# EAGLE design Enclosure 100x68 BHWL3 (EAGLE 9.6.2)
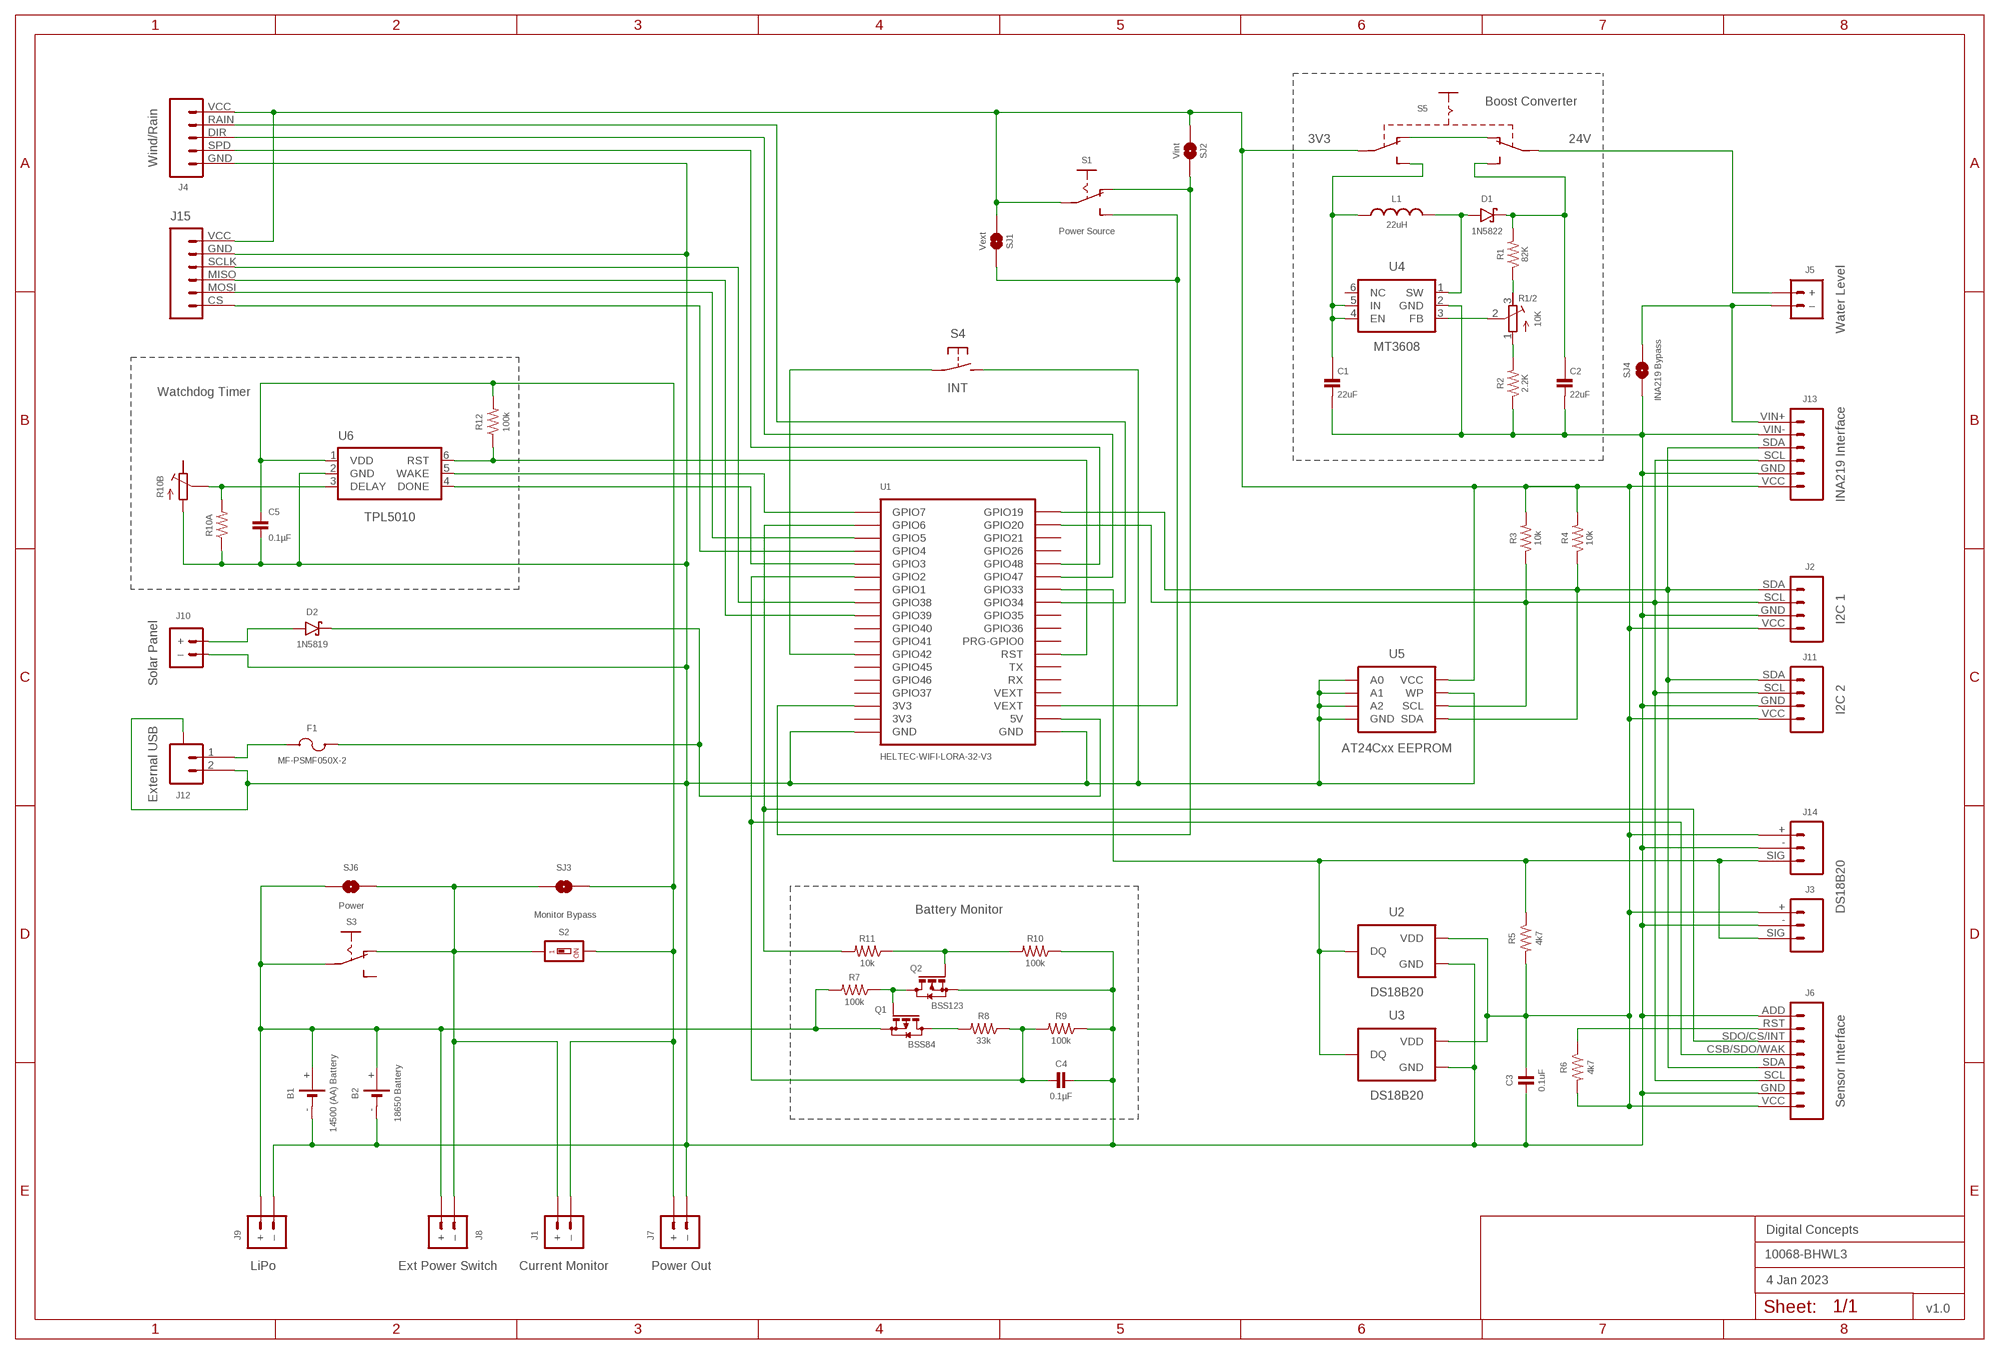
[diagram p0: schematic, sheet 1]
FRAME2 (A3L-LOC): DATE: 4 Jan 2023; OWNER: Digital Concepts; TITLE: 10068-BHWL3; VERSION: v1.0

## Parts
B1  14500 (AA) Battery  BATTERY-HOLDER-14500(AA)  [BATTERY-14500]
B2  18650 Battery  BATTERY-HOLDER-18650  [BATTERY-18650]
C1  22uF  CAPACITOR-1206  [C1206]
C2  22uF  CAPACITOR-1206  [C1206]
C3  0.1uF  CAPACITOR-0805  [C0805]
C4  0.1µF  CAPACITOR-0805  [C0805]
C5  0.1µF  CAPACITOR-0805  [C0805]
D1  1N5822  DIODE-SCHOTTKY-1N5822  [DIODE_SMB]
D2  1N5819  1N5819-SOD-123  [SOD-123]
F1  MF-PSMF050X-2  [F0805]
J1  Current Monitor  JST-PH2.0-2-HORIZONTALJST-PTH-2  [JST-PH2.0-2-HORIZONTAL]
J2  I2C 1  JST-PH2.0-4-VERTICAL-I2C  [JST-PH2.0-4-VERTICAL-I2C]
J3  DS18B20  JST-PH2.0-3-VERTICAL-DS18B20  [JST-PH2.0-3-VERTICAL-SIG]
J4  Wind/Rain  JST-PH2.0-5-DUAL-WEATHER  [JST-PH2.0-5-DUAL-WEATHER]
J5  Water Level  JST-PH2.0-2-DUAL-POWERJST-PTH-2  [JST-PH2.0-2-DUAL-POWER]
J6  Sensor Interface  HEADER-1X8-SENSOR  [CONN_08-SENSOR]
J7  Power Out  JST-GH1.25-2-HORIZONTAL-POWER  [JST-GH1.25-2-HORIZONTAL]
J8  Ext Power Switch  JST-PH2.0-2-DUAL-POWERJST-PTH-2  [JST-PH2.0-2-DUAL-POWER]
J9  LiPo  JST-PH2.0-2-HORIZONTAL-POWERJST-PTH-2  [JST-PH2.0-2-HORIZONTAL-POWER]
J10  Solar Panel  JST-PH2.0-2-VERTICAL  [JST-PH2.0-2-VERTICAL=POWER]
J11  I2C 2  JST-PH2.0-I2C-MALE-HORIZONTAL  [JST-PH2.0-4-HORIZONTAL]
J12  External USB  JST-SH1.0-2-SMD-HORIZONTAL  [JST-SH1.0-2-HORIZONTAL]
J13  INA219 Interface  INA219-I2C-MODULE  [CONN_06-INA219]
J14  JST-PH2.0-3-HORIZONTAL-DS18B20  [JST-PH2.0-DS18B20-HORIZONTAL]
J15  JST-PH2.0-6-HORIZONTAL-SPI  [JST-PH2.0-6-HORIZONTAL-SPI]
L1  22uH  INDUCTOR-CDRH104R/6D28L5038P  [CDRH104R+6D28]
Q1  BSS84  [SOT23-3]
Q2  BSS123  MOSFET-BSS123  [SOT23-3]
R1  82K  RESISTORR0805  [R0805]
R1/2  10K  RESISTOR-TRIMM-BAOTER-HORIZONTAL  [RTRIM64P]
R2  2.2K  RESISTORR0805  [R0805]
R3  10k  RESISTORR0805  [R0805]
R4  10k  RESISTORR0805  [R0805]
R5  4k7  RESISTORR0805  [R0805]
R6  4k7  RESISTORR0805  [R0805]
R7  100k  RESISTORR0805  [R0805]
R8  33k  RESISTORR0805  [R0805]
R9  100k  RESISTORR0805  [R0805]
R10  100k  RESISTORR0805  [R0805]
R10A  RESISTORR0805  [R0805]
R10B  RESISTOR-TRIMM-33  [RTRIM3*3]
R11  10k  RESISTORR0805  [R0805]
R12  100k  RESISTORR0805  [R0805]
S1  Power Source  SWITCH-SLIDE-SPDT-SMT  [SWITCH-SPDT-SMT]
S2  Monitor Bypass  SWITCH-DIP-SWS001  [SMD-001]
S3  Power  SWITCH-SLIDE-SPDT-PTH  [SWITCH-SPDT-PTH]
S4  INT  SWITCH-MOMENTARY-2-PIN  [SWITCH-2-PAD]
S5  SWITCH-SLIDE-DPDT-PTH-S  [SWITCH-DPDT-PTH]
SJ1  Vext  SJ  [SJ]
SJ2  Vint  SJ-V-2  [SJ-VIA-2]
SJ3  Monitor  SJ  [SJ]
SJ4  INA219 Bypass  SJ  [SJ]
SJ6  Power  SJ  [SJ]
U1  HELTEC-WIFI-LORA-32-V3  [HELTEC-WIFI-LORA-32-V3]
U2  DS18B20  THERMOMETER-DS18B20  [TO-92]
U3  DS18B20  THERMOMETER-DS18B20  [TO-92]
U4  MT3608  [SOT-23-6@1]
U5  AT24Cxx EEPROM  AT24CXX-EEPROM  [SOP-8]
U6  TPL5010  TPL5010DDCR  [SOT-23-6]

## Nets
GND: B1.- B2.- C1.2 C2.2 C3.2 C4.2 C5.2 J2.GND J3.- J4.GND J6.ADD J6.GND J7.-(–) J9.-(–) J10.-(–) J11.GND J12.2 J12.A@1(A) J12.A@2(A) J13.GND J13.VIN- J14.- J15.GND Q2.2(S) R2.1 R9.1 R10.1 R10A.1 R10B.1(A) S4.P$2(S) SJ4.1 U1.GND@1(GND) U1.GND@36(GND) U2.1(GND) U3.1(GND) U4.2(GND) U5.P$1(A0) U5.P$2(A1) U5.P$3(A2) U5.P$4(GND) U5.P$7(WP) U6.2(GND)
N$1: D2.A J10.+
N$2: J3.SIG J14.SIG R5.1 U1.GPIO33 U2.2(DQ) U3.2(DQ)
N$3: C4.1 J6.CSB/SDO/WAK R8.1 R9.2 U1.GPIO2
N$4: J2.SCL J6.SCL J11.SCL J13.SCL R3.1 U1.GPIO20 U5.P$6(SCL)
N$5: D2.C F1.1 U1.5V
N$6: D1.A L1.1 U4.1(SW)
N$7: Q1.3(D) R8.2
N$9: J6.RST R6.1
N$10: C5.1 J1.2(–) J7.+ R12.2 S2.2 SJ3.1 U6.1(VDD)
N$11: J2.SDA J6.SDA J11.SDA J13.SDA R4.1 U1.GPIO19 U5.P$5(SDA)
N$12: U1.GPIO7 U6.5(WAKE)
N$13: S1.3(S) SJ1.1 U1.VEXT@3(VEXT)
N$14: F1.2 J12.1
N$15: J5.-(–) J13.VIN+ SJ4.2
N$16: S4.P$1(P) U1.GPIO42
N$17: R1.1 R1/2.3(E)
N$18: R10A.2 R10B.2(S) U6.3(DELAY)
N$19: S1.1(O) SJ2.1 U1.3V3@34(3V3)
N$20: J5.+ S5.P$2(P1)
N$21: J1.1(+) J8.-(–) S2.1 S3.1(O) SJ3.2 SJ6.1
N$22: R1/2.2(S) U4.3(FB)
N$23: R1/2.1(A) R2.2
N$24: U1.GPIO3 U6.4(DONE)
N$25: C1.1 L1.2 S5.P$6(S2) U4.4(EN) U4.5(IN)
N$26: S5.P$1(O1) S5.P$4(O2)
N$27: J15.SCLK U1.GPIO38
N$28: C2.1 D1.C R1.2 S5.P$3(S1)
N$29: J15.MOSI U1.GPIO5
N$30: B1.+ B2.+ J8.+ J9.+ Q1.2(S) R7.2 S3.2(P) SJ6.2
N$31: J15.MISO U1.GPIO39
N$32: J6.SDO/CS/INT R11.2 U1.GPIO6
N$33: J15.CS U1.GPIO4
N$34: R12.1 U1.RST U6.6(RST)
N$35: Q1.1(G) Q2.3(D) R7.1
N$37: Q2.1(G) R10.2 R11.1
N$38: J4.SPD U1.GPIO48
N$39: J4.DIR U1.GPIO47
N$40: J4.RAIN U1.GPIO34
VEXT: C3.1 J2.VCC J3.+ J4.VCC J6.VCC J11.VCC J13.VCC J14.+ J15.VCC R3.2 R4.2 R5.2 R6.2 S1.2(P) S5.P$5(P2) SJ1.2 SJ2.2 SJ2.2@V U2.3(VDD) U3.3(VDD) U5.P$8(VCC)
Unconnected: R10B.3(E) S3.3(S) U1.3V3@35(3V3) U1.GPIO0(PRG-GPIO0) U1.GPIO1 U1.GPIO21 U1.GPIO26 U1.GPIO35 U1.GPIO36 U1.GPIO37 U1.GPIO40 U1.GPIO41 U1.GPIO45 U1.GPIO46 U1.RX U1.TX U1.VEXT@4(VEXT) U4.6(NC)

## Notes on the sheet
- Boost Converter
- 3V3 | 24V
- Watchdog Timer
- Battery Monitor

## Library data of the parts
B1 = digitalconcepts:BATTERY-HOLDER-14500(AA): 14500 (AA) battery holder
B2 = digitalconcepts:BATTERY-HOLDER-18650: 18650 Battery Holder
C1 C2 = digitalconcepts:CAPACITOR-1206: 1206 Capacitor
C3-C5 = digitalconcepts:CAPACITOR-0805: 0805 Capacitor
D1 = digitalconcepts:DIODE-SCHOTTKY-1N5822: 1N5822 Schottky Diode SMB
D2 = digitalconcepts:1N5819-SOD-123: 1N5819 Schottky Diode SOD-123
F1 = digitalconcepts:MF-PSMF050X-2: PTC Resettable Fuse 0.5A/6V 500mA SMD
J1 = digitalconcepts:JST-PH2.0-2-HORIZONTAL: PH2.0 2P Right Angle PCB Connector; PROD_ID: CONN-09863; SKU: PRT-09914
J2 = digitalconcepts:JST-PH2.0-4-VERTICAL-I2C: PH2.0 4P I2C Vertical Connector
J3 = digitalconcepts:JST-PH2.0-3-VERTICAL-DS18B20: DS18B20 PH2.0 Vertical PCB Connector
J4 = digitalconcepts:JST-PH2.0-5-DUAL-WEATHER: PH2.0 5P Dual Connector
J5 J8 = digitalconcepts:JST-PH2.0-2-DUAL-POWER: JST PH2.0 2P PTH Dual-Side Connector (Power); PROD_ID: CONN-09863; SKU: PRT-09914
J6 = digitalconcepts:HEADER-1X8-SENSOR: IoT Sensors 1x8 Pin Header for 'Sandwich' IoT Sensors
J7 = digitalconcepts:JST-GH1.25-2-HORIZONTAL-POWER: JST GH1.25 2P PTH Connector (Power)
J9 = digitalconcepts:JST-PH2.0-2-HORIZONTAL-POWER: PH2.0 2P Right Angle PCB Connector; PROD_ID: CONN-09863; SKU: PRT-09914
J10 = digitalconcepts:JST-PH2.0-2-VERTICAL: PH2.0 2P PCB Connector
J11 = digitalconcepts:JST-PH2.0-I2C-MALE-HORIZONTAL: PH2.0 4P (I2C) Right Angle PCB Connector
J12 = digitalconcepts:JST-SH1.0-2-SMD-HORIZONTAL: JST SH1.0 2P SMD Horizontal Connector
J13 = digitalconcepts:INA219-I2C-MODULE: INA219 I2C Module
J14 = digitalconcepts:JST-PH2.0-3-HORIZONTAL-DS18B20: DS18B20 PH2.0 Right Angle PCB Connector
J15 = digitalconcepts:JST-PH2.0-6-HORIZONTAL-SPI: PH2.0 6P Horizontal Connector—SPI
L1 = digitalconcepts:INDUCTOR-CDRH104R/6D28: Inductor; SPICEPREFIX: L
Q1 = digitalconcepts:BSS84: P-CHANNEL MOS FET
Q2 = digitalconcepts:MOSFET-BSS123: N-CHANNEL MOS FET
R1-R10 R10A R11 R12 = digitalconcepts:RESISTOR: Resistor; SPICEPREFIX: R
R1/2 = digitalconcepts:RESISTOR-TRIMM-BAOTER-HORIZONTAL: Trimm Resistor - Horizontal BAOTER
R10B = digitalconcepts:RESISTOR-TRIMM-3*3: Trimm Resistor - 3*3 SMD
S1 = digitalconcepts:SWITCH-SLIDE-SPDT-SMT: Mini Sliding Switch SPDT SMT
S2 = digitalconcepts:SWITCH-DIP-SWS001: SMD Dip Switch 1 pol.
S3 = digitalconcepts:SWITCH-SLIDE-SPDT-PTH: Mini Sliding Switch SPDT PTH
S4 = digitalconcepts:SWITCH-MOMENTARY-2-PIN: 2 Pin Momentary Switch
S5 = digitalconcepts:SWITCH-SLIDE-DPDT-PTH-S: Switch DPDT PTH-S
SJ1 SJ3 SJ4 SJ6 = digitalconcepts:SJ: Solder Jumper
SJ2 = digitalconcepts:SJ-V-2: Solder Jumper with Pad Vias
U1 = digitalconcepts:HELTEC-WIFI-LORA-32-V3: Heltec WiFi LoRa 32 Development Board V3
U2 U3 = digitalconcepts:THERMOMETER-DS18B20: Digital Thermometer -55C-125C TO92-3; AVAILABILITY: Bad; DESCRIPTION: Temperature Sensor Digital, Local -55°C ~ 125°C 12 b 8-uMAX; MF: Maxim Integrated; MP: DS18B20; PACKAGE: TO-92 Maxim Integrated; PRICE: None
U4 = digitalconcepts:MT3608: MT3608 DC-DC Step-Up Voltage Converter
U5 = digitalconcepts:AT24CXX-EEPROM: AT24Cxx EEPROM SOP-8
U6 = digitalconcepts:TPL5010DDCR: TPL5010 Nano-Power System Timer with Watchdog

## Board
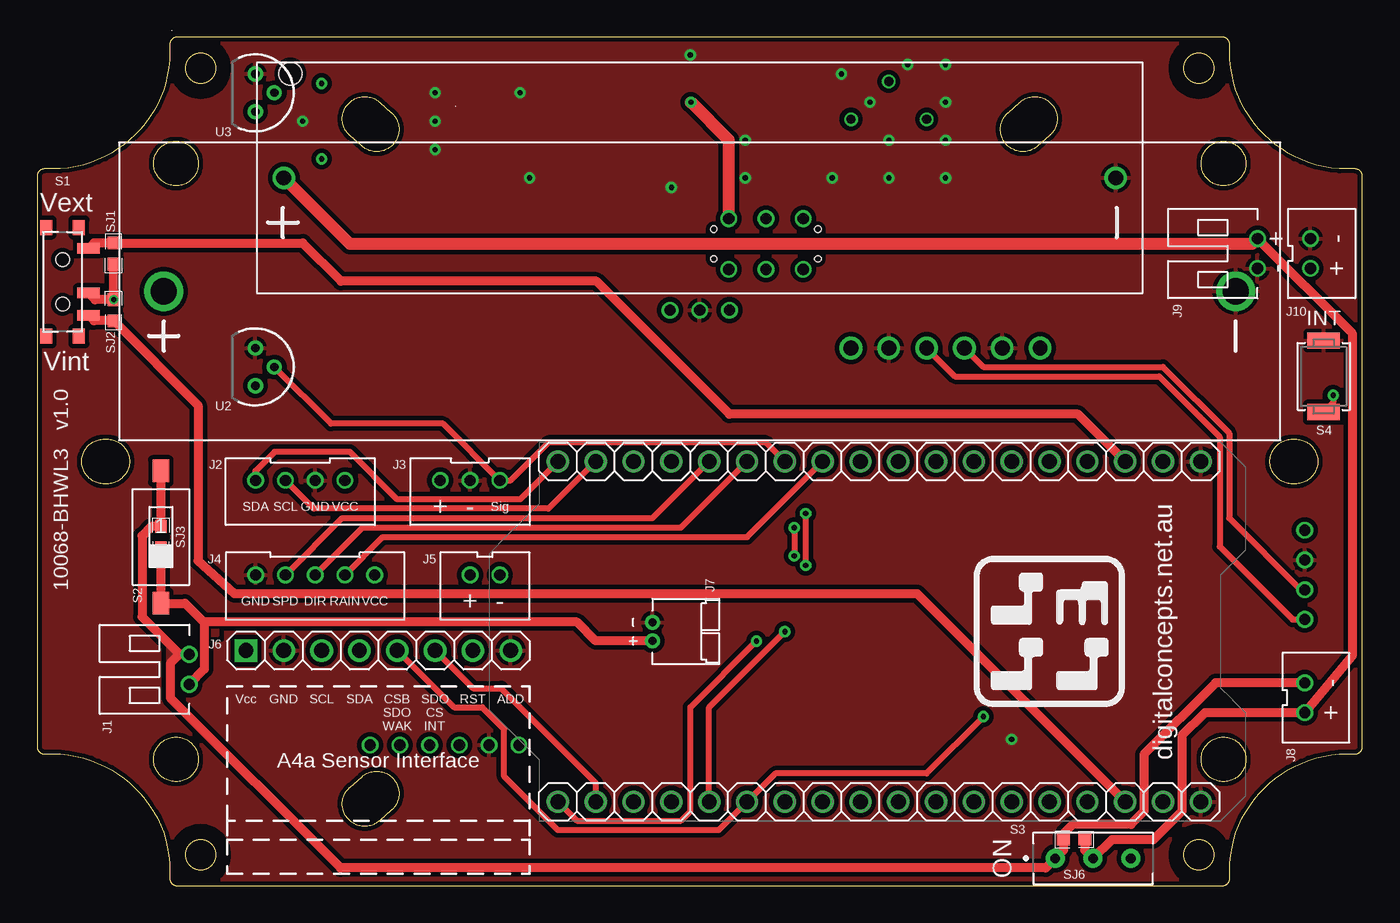
[diagram p1: board, top side]
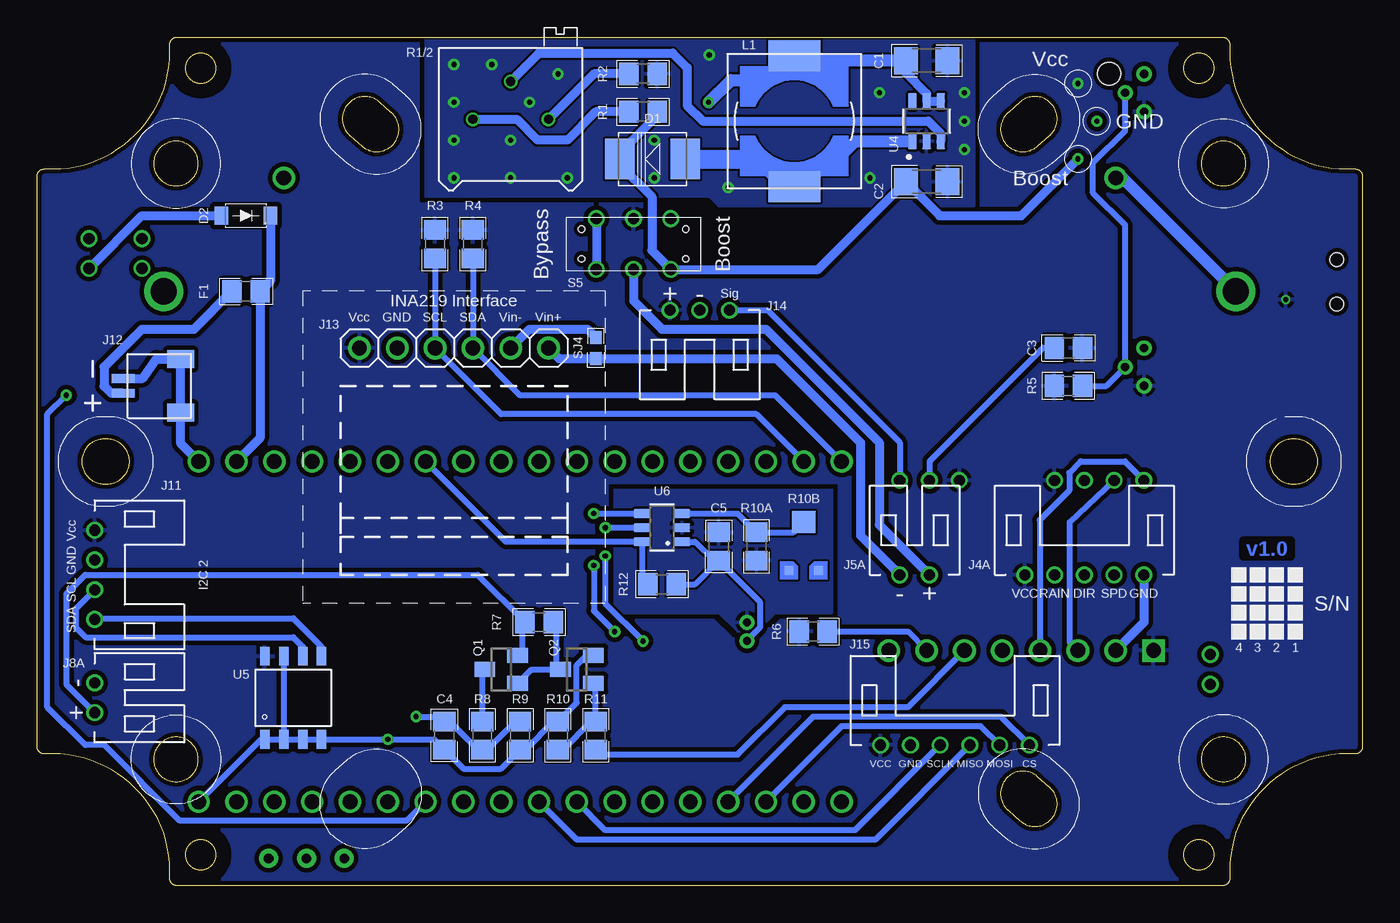
[diagram p2: board, bottom side, seen from below]

Size 89 x 57 mm. Coordinates in mm from the lower left corner, seen from the top.
Outline: 23.78,51.94 22.98,52.64 22.98,52.64 22.94,52.68 22.89,52.72 22.83,52.76 22.75,52.81 22.67,52.86 22.58,52.89 22.49,52.93 22.4,52.96 22.3,52.98 22.2,53 22.1,53.01 21.89,53.01 21.79,53 21.69,52.98 21.6,52.96 21.5,52.93 21.41,52.89 21.32,52.86 21.24,52.81 21.16,52.76 21.08,52.7 21,52.64 20.93,52.57 20.87,52.5 20.81,52.43 20.75,52.35 20.7,52.27 20.65,52.19 20.61,52.1 20.58,52.01 20.55,51.91 20.53,51.81 20.51,51.72 20.5,51.62 20.5,51.41 20.51,51.31 20.53,51.21 20.55,51.11 20.58,51.02 20.61,50.93 20.65,50.84 20.7,50.75 20.75,50.67 20.81,50.59 20.87,50.52 20.93,50.45 20.96,50.43 20.98,50.41 21.01,50.38 21.01,50.38 21.81,49.68 21.81,49.68 21.86,49.64 21.91,49.6 21.96,49.57 22.04,49.51 22.12,49.47 22.21,49.43 22.3,49.39 22.4,49.36 22.49,49.34 22.59,49.32 22.69,49.31 22.9,49.31 23,49.32 23.1,49.34 23.2,49.36 23.29,49.39 23.38,49.43 23.47,49.47 23.55,49.51 23.63,49.57 23.71,49.62 23.79,49.68 23.86,49.75 23.92,49.82 23.99,49.89 24.04,49.97 24.09,50.05 24.14,50.14 24.18,50.23 24.22,50.32 24.25,50.41 24.26,50.51 24.28,50.61 24.3,50.71 24.3,50.92 24.28,51.02 24.26,51.11 24.25,51.21 24.22,51.31 24.18,51.4 24.14,51.48 24.09,51.57 24.04,51.65 23.99,51.73 23.92,51.8 23.83,51.9 23.81,51.92 23.78,51.94
Outline: 23.78,51.94 23.78,51.94
Outline: 23.78,5.06 23.81,5.08 23.83,5.1 23.86,5.13 23.92,5.19 23.99,5.27 24.04,5.35 24.09,5.43 24.14,5.51 24.18,5.6 24.22,5.69 24.25,5.79 24.27,5.88 24.29,5.98 24.3,6.08 24.3,6.29 24.29,6.39 24.27,6.49 24.25,6.59 24.22,6.68 24.18,6.77 24.14,6.86 24.09,6.95 24.04,7.03 23.99,7.11 23.92,7.18 23.86,7.25 23.79,7.32 23.71,7.38 23.63,7.43 23.55,7.49 23.47,7.53 23.38,7.57 23.29,7.61 23.2,7.64 23.1,7.66 23,7.68 22.9,7.69 22.69,7.69 22.59,7.68 22.49,7.66 22.4,7.64 22.3,7.61 22.21,7.57 22.12,7.53 22.04,7.49 21.96,7.43 21.91,7.4 21.86,7.36 21.81,7.32 21.81,7.32 21.01,6.62 21.01,6.61 20.98,6.59 20.96,6.57 20.93,6.55 20.87,6.48 20.81,6.41 20.75,6.33 20.7,6.25 20.65,6.16 20.61,6.07 20.58,5.98 20.55,5.89 20.53,5.79 20.51,5.69 20.5,5.59 20.5,5.38 20.51,5.28 20.55,5.09 20.58,4.99 20.61,4.9 20.65,4.81 20.7,4.73 20.75,4.65 20.81,4.57 20.87,4.49 20.93,4.43 21,4.36 21.08,4.3 21.16,4.24 21.24,4.19 21.32,4.14 21.41,4.1 21.5,4.07 21.6,4.04 21.69,4.02 21.79,4 21.89,3.99 22.1,3.99 22.2,4 22.3,4.02 22.4,4.04 22.49,4.07 22.58,4.1 22.67,4.14 22.75,4.19 22.83,4.24 22.89,4.28 22.94,4.32 22.98,4.36 22.98,4.36 23.78,5.06
Outline: 23.78,5.06 23.78,5.06
Outline: 88.99,47.76 88.98,47.79 88.97,47.83 88.96,47.86 88.95,47.88 88.93,47.91 88.92,47.94 88.9,47.96 88.88,47.99 88.86,48.01 88.83,48.03 88.81,48.05 88.78,48.07 88.76,48.09 88.73,48.1 88.7,48.12 88.67,48.13 88.64,48.14 88.61,48.14 88.57,48.15 88.54,48.15 87.46,48.15 86.93,48.21 86.42,48.31 85.9,48.42 85.4,48.57 84.93,48.77 84.46,48.97 84.01,49.22 83.59,49.5 83.17,49.78 82.77,50.1 82.42,50.46 82.06,50.81 81.74,51.2 81.45,51.62 81.17,52.04 80.92,52.49 80.52,53.43 80.37,53.92 80.26,54.43 80.15,54.94 80.1,55.47 80.1,56.54 80.1,56.58 80.09,56.61 80.08,56.64 80.07,56.67 80.06,56.7 80.05,56.73 80.03,56.76 80.02,56.78 80,56.81 79.98,56.83 79.96,56.86 79.93,56.88 79.91,56.9 79.88,56.92 79.86,56.93 79.83,56.95 79.8,56.96 79.77,56.97 79.74,56.98 79.7,56.99 79.67,57 79.64,57 9.36,57 9.33,57 9.3,56.99 9.26,56.98 9.23,56.97 9.2,56.96 9.17,56.95 9.14,56.93 9.12,56.92 9.09,56.9 9.07,56.88 9.02,56.83 9,56.81 8.98,56.78 8.97,56.76 8.95,56.73 8.94,56.7 8.93,56.67 8.92,56.64 8.91,56.61 8.9,56.58 8.9,56.54 8.9,55.47 8.84,54.94 8.74,54.43 8.63,53.92 8.48,53.43 8.28,52.96 8.08,52.49 7.83,52.04 7.55,51.62 7.26,51.2 6.94,50.81 6.58,50.46 6.22,50.1 5.83,49.78 5.41,49.5 4.99,49.22 4.54,48.97 4.07,48.77 3.59,48.57 3.1,48.42 2.58,48.31 2.07,48.21 1.54,48.15 0.46,48.15 0.43,48.15 0.39,48.14 0.36,48.14 0.33,48.13 0.3,48.12 0.27,48.1 0.24,48.09 0.22,48.07 0.19,48.05 0.17,48.03 0.14,48.01 0.12,47.99 0.1,47.96 0.08,47.94 0.07,47.91 0.05,47.88 0.04,47.86 0.03,47.83 0.02,47.79 0.01,47.76 0,47.73 0,47.7 0,9.3 0,9.27 0.01,9.24 0.02,9.2 0.03,9.17 0.04,9.14 0.05,9.11 0.07,9.09 0.08,9.06 0.1,9.03 0.12,9.01 0.14,8.99 0.17,8.97 0.19,8.95 0.22,8.93 0.24,8.91 0.27,8.9 0.3,8.88 0.33,8.87 0.36,8.86 0.39,8.85 0.43,8.85 0.46,8.84 1.54,8.84 2.07,8.79 2.58,8.68 3.1,8.58 3.59,8.43 4.07,8.23 4.54,8.03 4.99,7.78 5.41,7.5 5.83,7.22 6.22,6.9 6.58,6.54 6.94,6.19 7.26,5.8 7.55,5.38 7.83,4.96 8.08,4.51 8.28,4.04 8.48,3.57 8.63,3.08 8.74,2.57 8.84,2.06 8.9,1.53 8.9,0.46 8.9,0.42 8.91,0.39 8.92,0.36 8.93,0.33 8.94,0.3 8.95,0.27 8.97,0.24 8.98,0.22 9,0.19 9.02,0.17 9.04,0.14 9.07,0.12 9.09,0.1 9.12,0.08 9.14,0.07 9.17,0.05 9.2,0.04 9.23,0.03 9.26,0.02 9.29,0.01 9.33,0 9.36,0 79.64,0 79.67,0 79.7,0.01 79.74,0.02 79.77,0.03 79.8,0.04 79.83,0.05 79.86,0.07 79.88,0.08 79.91,0.1 79.93,0.12 79.96,0.14 79.98,0.17 80,0.19 80.02,0.22 80.03,0.24 80.05,0.27 80.06,0.3 80.07,0.33 80.08,0.36 80.09,0.39 80.1,0.42 80.1,0.46 80.1,1.53 80.15,2.06 80.26,2.57 80.37,3.08 80.52,3.57 80.92,4.51 81.17,4.96 81.45,5.38 81.74,5.8 82.06,6.19 82.42,6.54 82.77,6.9 83.17,7.22 83.59,7.5 84.01,7.78 84.46,8.03 84.93,8.23 85.4,8.43 85.9,8.58 86.42,8.68 86.93,8.79 87.46,8.84 88.54,8.84 88.57,8.85 88.61,8.85 88.64,8.86 88.67,8.87 88.7,8.88 88.73,8.9 88.76,8.91 88.78,8.93 88.81,8.95 88.83,8.97 88.86,8.99 88.88,9.01 88.9,9.04 88.92,9.06 88.93,9.09 88.95,9.12 88.96,9.15 88.97,9.17 88.98,9.21 88.99,9.24 89,9.27 89,9.3 89,47.7 89,47.73 88.99,47.76
Outline: 6.16,28.2 6.14,28.1 6.12,28.01 6.08,27.92 6.04,27.83 5.99,27.74 5.94,27.66 5.88,27.58 5.82,27.51 5.76,27.44 5.69,27.37 5.61,27.31 5.53,27.26 5.45,27.2 5.37,27.16 5.28,27.12 5.19,27.08 5.09,27.05 5,27.03 4.9,27.01 4.8,27 4.39,27 4.29,27.01 4.19,27.03 4.09,27.05 4,27.08 3.91,27.12 3.82,27.16 3.74,27.2 3.66,27.26 3.58,27.31 3.5,27.37 3.43,27.44 3.37,27.51 3.3,27.58 3.25,27.66 3.2,27.74 3.15,27.83 3.11,27.92 3.07,28.01 3.04,28.1 3.02,28.2 3.01,28.3 2.99,28.4 2.99,28.6 3.01,28.7 3.02,28.8 3.04,28.9 3.07,28.99 3.15,29.17 3.2,29.26 3.25,29.34 3.3,29.42 3.37,29.49 3.43,29.56 3.5,29.63 3.58,29.69 3.66,29.74 3.74,29.8 3.82,29.84 3.91,29.88 4,29.92 4.09,29.95 4.19,29.97 4.29,29.99 4.39,30 4.8,30 4.9,29.99 5,29.97 5.09,29.95 5.19,29.92 5.28,29.88 5.37,29.84 5.45,29.8 5.53,29.74 5.61,29.69 5.69,29.63 5.76,29.56 5.82,29.49 5.88,29.42 5.94,29.34 5.99,29.26 6.04,29.17 6.08,29.08 6.12,28.99 6.14,28.9 6.16,28.8 6.18,28.7 6.19,28.6 6.19,28.4 6.18,28.3 6.16,28.2
Outline: 10.79,8.18 10.77,8.09 10.74,7.99 10.7,7.9 10.66,7.81 10.62,7.73 10.56,7.65 10.51,7.57 10.45,7.49 10.38,7.42 10.31,7.36 10.24,7.3 10.16,7.24 10.08,7.19 9.99,7.14 9.9,7.1 9.81,7.06 9.72,7.03 9.62,7.01 9.53,6.99 9.42,6.98 9.22,6.98 9.12,6.99 9.02,7.01 8.92,7.03 8.83,7.06 8.74,7.1 8.65,7.14 8.56,7.19 8.48,7.24 8.4,7.3 8.33,7.36 8.26,7.42 8.19,7.49 8.13,7.57 8.08,7.65 8.02,7.73 7.98,7.81 7.94,7.9 7.9,7.99 7.87,8.09 7.85,8.18 7.83,8.28 7.82,8.38 7.82,8.59 7.83,8.69 7.85,8.79 7.87,8.88 7.9,8.98 7.94,9.07 7.98,9.16 8.02,9.24 8.08,9.32 8.13,9.4 8.19,9.48 8.26,9.55 8.33,9.61 8.4,9.67 8.48,9.73 8.56,9.78 8.65,9.83 8.74,9.87 8.83,9.9 8.92,9.93 9.02,9.95 9.12,9.97 9.22,9.98 9.42,9.98 9.53,9.97 9.62,9.95 9.72,9.93 9.81,9.9 9.9,9.87 9.99,9.83 10.08,9.78 10.16,9.73 10.24,9.67 10.31,9.61 10.38,9.55 10.45,9.48 10.51,9.4 10.56,9.32 10.62,9.24 10.66,9.16 10.7,9.07 10.74,8.98 10.77,8.88 10.79,8.79 10.81,8.69 10.82,8.59 10.82,8.38 10.81,8.28 10.79,8.18
Outline: 10.79,48.21 10.77,48.11 10.74,48.02 10.7,47.93 10.66,47.84 10.62,47.76 10.56,47.68 10.51,47.6 10.45,47.52 10.38,47.45 10.31,47.39 10.24,47.32 10.16,47.27 10.08,47.22 9.99,47.17 9.9,47.13 9.81,47.09 9.72,47.06 9.62,47.04 9.53,47.03 9.42,47.01 9.22,47.01 9.12,47.03 9.02,47.04 8.92,47.06 8.83,47.09 8.74,47.13 8.65,47.17 8.56,47.22 8.48,47.27 8.4,47.32 8.33,47.39 8.26,47.45 8.19,47.52 8.13,47.6 8.08,47.68 8.02,47.76 7.98,47.84 7.94,47.93 7.9,48.02 7.87,48.11 7.85,48.21 7.83,48.31 7.82,48.41 7.82,48.62 7.83,48.72 7.85,48.82 7.87,48.91 7.9,49.01 7.94,49.1 7.98,49.19 8.02,49.27 8.08,49.35 8.13,49.43 8.19,49.51 8.26,49.58 8.33,49.64 8.4,49.7 8.48,49.76 8.56,49.81 8.65,49.86 8.74,49.9 8.83,49.93 8.92,49.96 9.02,49.98 9.12,50 9.22,50.01 9.42,50.01 9.53,50 9.62,49.98 9.72,49.96 9.81,49.93 9.9,49.9 9.99,49.86 10.08,49.81 10.16,49.76 10.24,49.7 10.31,49.64 10.38,49.58 10.45,49.51 10.51,49.43 10.56,49.35 10.62,49.27 10.66,49.19 10.7,49.1 10.74,49.01 10.77,48.91 10.79,48.82 10.81,48.72 10.82,48.62 10.82,48.41 10.81,48.31 10.79,48.21
Outline: 64.73,51.11 64.75,51.21 64.78,51.31 64.82,51.4 64.86,51.49 64.91,51.57 64.96,51.65 65.01,51.73 65.08,51.8 65.14,51.87 65.17,51.9 65.19,51.92 65.22,51.94 65.22,51.94 66.02,52.64 66.02,52.64 66.06,52.68 66.11,52.72 66.17,52.76 66.25,52.81 66.33,52.86 66.42,52.89 66.51,52.93 66.6,52.96 66.7,52.98 66.8,53 66.9,53.01 67.11,53.01 67.21,53 67.31,52.98 67.4,52.96 67.5,52.93 67.59,52.89 67.68,52.86 67.76,52.81 67.84,52.76 67.92,52.7 68,52.64 68.06,52.57 68.13,52.5 68.19,52.43 68.25,52.35 68.3,52.27 68.35,52.19 68.39,52.1 68.42,52.01 68.45,51.91 68.47,51.81 68.49,51.72 68.5,51.62 68.5,51.41 68.49,51.31 68.47,51.21 68.45,51.11 68.42,51.02 68.39,50.93 68.35,50.84 68.3,50.75 68.25,50.67 68.19,50.59 68.13,50.52 68.06,50.45 68.04,50.43 68.02,50.41 67.99,50.38 67.99,50.38 67.19,49.68 67.19,49.68 67.14,49.64 67.09,49.6 67.04,49.57 66.96,49.51 66.88,49.47 66.79,49.43 66.7,49.39 66.6,49.36 66.51,49.34 66.41,49.32 66.31,49.31 66.1,49.31 66,49.32 65.9,49.34 65.8,49.36 65.71,49.39 65.62,49.43 65.53,49.47 65.45,49.51 65.37,49.57 65.29,49.62 65.21,49.68 65.14,49.75 65.08,49.82 65.01,49.89 64.96,49.97 64.91,50.05 64.86,50.14 64.82,50.23 64.78,50.32 64.75,50.41 64.73,50.51 64.71,50.61 64.7,50.71 64.7,50.92 64.71,51.02 64.73,51.11
Outline: 81.15,8.18 81.13,8.09 81.1,7.99 81.06,7.9 81.02,7.81 80.98,7.73 80.92,7.65 80.87,7.57 80.81,7.49 80.74,7.42 80.67,7.36 80.6,7.3 80.52,7.24 80.44,7.19 80.35,7.14 80.26,7.1 80.17,7.06 80.08,7.03 79.98,7.01 79.88,6.99 79.78,6.98 79.58,6.98 79.47,6.99 79.38,7.01 79.28,7.03 79.18,7.06 79.1,7.1 79,7.14 78.92,7.19 78.84,7.24 78.76,7.3 78.69,7.36 78.62,7.42 78.55,7.49 78.49,7.57 78.43,7.65 78.38,7.73 78.33,7.81 78.3,7.9 78.26,7.99 78.23,8.09 78.21,8.18 78.19,8.28 78.18,8.38 78.18,8.59 78.19,8.69 78.21,8.79 78.23,8.88 78.26,8.98 78.3,9.07 78.33,9.16 78.38,9.24 78.43,9.32 78.49,9.4 78.55,9.48 78.62,9.55 78.69,9.61 78.76,9.67 78.84,9.73 78.92,9.78 79,9.83 79.1,9.87 79.18,9.9 79.28,9.93 79.38,9.95 79.47,9.97 79.58,9.98 79.78,9.98 79.88,9.97 79.98,9.95 80.08,9.93 80.17,9.9 80.26,9.87 80.35,9.83 80.44,9.78 80.52,9.73 80.6,9.67 80.67,9.61 80.74,9.55 80.81,9.48 80.87,9.4 80.92,9.32 80.98,9.24 81.02,9.16 81.06,9.07 81.1,8.98 81.13,8.88 81.15,8.79 81.17,8.69 81.18,8.59 81.18,8.38 81.17,8.28 81.15,8.18
Outline: 81.15,48.21 81.13,48.11 81.1,48.02 81.06,47.93 81.02,47.84 80.98,47.76 80.92,47.68 80.87,47.6 80.81,47.52 80.74,47.45 80.67,47.39 80.6,47.32 80.52,47.27 80.44,47.22 80.35,47.17 80.26,47.13 80.17,47.09 80.08,47.07 79.98,47.05 79.88,47.03 79.78,47.01 79.58,47.01 79.47,47.03 79.38,47.05 79.28,47.07 79.18,47.09 79.1,47.13 79,47.17 78.92,47.22 78.84,47.27 78.76,47.32 78.69,47.39 78.62,47.45 78.55,47.52 78.49,47.6 78.43,47.68 78.38,47.76 78.33,47.84 78.3,47.93 78.26,48.02 78.23,48.11 78.21,48.21 78.19,48.31 78.18,48.41 78.18,48.62 78.19,48.72 78.21,48.82 78.23,48.91 78.26,49.01 78.3,49.1 78.33,49.19 78.38,49.27 78.43,49.35 78.49,49.43 78.55,49.51 78.62,49.57 78.69,49.64 78.76,49.7 78.84,49.76 78.92,49.81 79,49.86 79.1,49.9 79.18,49.93 79.28,49.96 79.38,49.98 79.47,50 79.58,50.01 79.78,50.01 79.88,50 79.98,49.98 80.08,49.96 80.17,49.93 80.26,49.9 80.35,49.86 80.44,49.81 80.52,49.76 80.6,49.7 80.67,49.64 80.74,49.57 80.81,49.51 80.87,49.43 80.92,49.35 80.98,49.27 81.02,49.19 81.06,49.1 81.1,49.01 81.13,48.91 81.15,48.82 81.17,48.72 81.18,48.62 81.18,48.41 81.17,48.31 81.15,48.21
Outline: 85.97,28.2 85.95,28.1 85.93,28.01 85.89,27.92 85.85,27.83 85.8,27.74 85.75,27.66 85.69,27.58 85.63,27.51 85.57,27.44 85.5,27.37 85.42,27.31 85.34,27.26 85.26,27.2 85.18,27.16 85.09,27.12 85,27.08 84.9,27.05 84.81,27.03 84.71,27.01 84.61,27 84.2,27 84.1,27.01 84,27.03 83.9,27.05 83.81,27.08 83.72,27.12 83.63,27.16 83.55,27.2 83.47,27.26 83.39,27.31 83.31,27.37 83.24,27.44 83.18,27.51 83.11,27.58 83.06,27.66 83.01,27.74 82.96,27.83 82.92,27.92 82.88,28.01 82.85,28.1 82.83,28.2 82.82,28.3 82.8,28.4 82.8,28.6 82.82,28.7 82.83,28.8 82.85,28.9 82.88,28.99 82.92,29.08 82.96,29.17 83.01,29.26 83.06,29.34 83.11,29.42 83.18,29.49 83.24,29.56 83.31,29.63 83.39,29.69 83.47,29.74 83.55,29.8 83.63,29.84 83.72,29.88 83.81,29.92 83.9,29.95 84,29.97 84.1,29.99 84.2,30 84.61,30 84.71,29.99 84.81,29.97 84.9,29.95 85,29.92 85.09,29.88 85.18,29.84 85.26,29.8 85.34,29.74 85.42,29.69 85.5,29.63 85.57,29.56 85.63,29.49 85.69,29.42 85.75,29.34 85.8,29.26 85.85,29.17 85.89,29.08 85.93,28.99 85.95,28.9 85.97,28.8 85.99,28.7 86,28.6 86,28.4 85.99,28.3 85.97,28.2
Outline: circle at 10.97,2.08 radius 1.02
Outline: circle at 10.97,54.92 radius 1.02
Outline: circle at 78.03,54.92 radius 1.02
Outline: circle at 78.03,2.08 radius 1.02
Copper layers (1*16): Top 0.035mm / dielectric 1.5mm / Bottom 0.035mm
Design rules "default *": minimum track width 6mil, minimum drill 0.35mm, track to track 6mil, track to pad 6mil, pad to pad 6mil, via to via 6mil, smd to smd 6mil, copper to edge 6mil, drill to drill 6mil, minimum pad ring 1mil, minimum via ring 8mil, stop-mask expansion 4mil, vias tented up to drill 0mil, thermal gap 10mil

### Footprints (pad centres in the part's own frame; a part is rotated, then mirrored left to right if it is on the bottom)
BATTERY-14500 = drill 1: + -27.94,0; - 27.94,0 | hole 1.524: -27.5,7
BATTERY-18650 = drill 1.75: + -36,0; - 36,0
C1206 = smd 1.6 x 1.8: 1 -1.4,0; 2 1.4,0
C0805 = smd 1.3 x 1.5: 1 -0.95,0; 2 0.95,0
DIODE_SMB = smd 2 x 2.7: A 2.2,0; C -2.2,0
SOD-123 = smd 0.91 x 1.22: A -1.65,0; C 1.65,0
F0805 = smd 1.3 x 1.5: 1 -0.95,0; 2 0.95,0
JST-PH2.0-2-HORIZONTAL = drill 0.75: 1 1,0; 2 -1,0
JST-PH2.0-4-VERTICAL-I2C = drill 0.75: GND 1,0; SCL -1,0; SDA -3,0; VCC 3,0
JST-PH2.0-3-VERTICAL-SIG = drill 0.75: + -2,0; - 0,0; SIG 2,0
JST-PH2.0-5-DUAL-WEATHER = drill 0.75: DIR 0,0; GND 4,0; RAIN -2,0; SPD 2,0; VCC -4,0
JST-PH2.0-2-DUAL-POWER = drill 0.75: + 1,0; - -1,0
CONN_08-SENSOR = drill 1 pad 1.524: ADD 17.78,0; CSB/SDO/WAK 10.16,0; GND 2.54,0; RST 15.24,0; SCL 5.08,0; SDA 7.62,0; SDO/CS/INT 12.7,0 | drill 1 pad 1.524 square: VCC 0,0
JST-GH1.25-2-HORIZONTAL = drill 0.55 pad 1.016: + -0.625,0; - 0.625,0
JST-PH2.0-2-HORIZONTAL-POWER = drill 0.75: + 1,0; - -1,0
JST-PH2.0-2-VERTICAL=POWER = drill 0.75: + -1,0; - 1,0
JST-PH2.0-4-HORIZONTAL = drill 0.75: GND -1,0; SCL 1,0; SDA 3,0; VCC -3,0
JST-SH1.0-2-HORIZONTAL = smd 0.6 x 1.55: 1 -0.5,2.54; 2 0.5,2.54 | smd 1.2 x 1.8: A@1 -1.8,-1.335; A@2 1.8,-1.335
CONN_06-INA219 = drill 1 pad 1.524: GND 2.54,0; SCL 5.08,0; SDA 7.62,0; VCC 0,0; VIN+ 12.7,0; VIN- 10.16,0
JST-PH2.0-DS18B20-HORIZONTAL = drill 0.75: + 2,0; - 0,0; SIG -2,0
JST-PH2.0-6-HORIZONTAL-SPI = drill 0.75: CS 5,0; GND -3,0; MISO 1,0; MOSI 3,0; SCLK -1,0; VCC -5,0
CDRH104R+6D28 = smd 2.1 x 3.5: 1 -4.4,0; 2 4.4,0
SOT23-3 = smd 1 x 1.4: 1 -0.95,-1.1; 2 0.95,-1.1; 3 0,1.1
R0805 = smd 1.3 x 1.5: 1 -0.95,0; 2 0.95,0
RTRIM64P = drill 0.61: 1 0,-2.54; 2 2.54,0; 3 0,2.54
RTRIM3*3 = smd 0.6 x 0.6: 1 -1,-1.6; 3 1,-1.6 | smd 1.6 x 1.5: 2 0,1.65
SWITCH-SPDT-SMT = smd 0.7 x 1.5: 1 2.25,1.75; 2 0.75,1.75; 3 -2.25,1.75 | smd 1 x 0.8: GND@1 3.65,-1.1; GND@2 3.65,1.1; GND@3 -3.65,1.1; GND@4 -3.65,-1.1 | hole 0.9: -1.5,0; 1.5,0
SMD-001 = smd 1.1 x 1.5: 1 0,-4.45; 2 0,4.45
SWITCH-SPDT-PTH = drill 0.65 pad 1.27: 1 -2.54,0; 2 0,0; 3 2.54,0
SWITCH-2-PAD = smd 1.067 x 2.184: P$1 -2.4,0; P$2 2.4,0
SWITCH-DPDT-PTH = drill 0.75: P$1 -1.7,2.5; P$2 -1.7,0; P$3 -1.7,-2.5; P$4 1.7,2.5; P$5 1.7,0; P$6 1.7,-2.5 | hole 0.42: 1,3.5; -1,3.5; 1,-3.5; -1,-3.5
SJ = smd 0.864 x 0.762: 1 -0.711,0; 2 0.711,0
SJ-VIA-2 = smd 0.864 x 0.762: 1 -0.711,0; 2 0.711,0 | drill 0.35 pad 0.61: 2@V 0.711,0
HELTEC-WIFI-LORA-32-V3 = drill 1: 3V3@34 -22.86,5.08; 3V3@35 -22.86,2.54; 5V 0,2.54; GND@1 0,0; GND@36 -22.86,0; GPIO0 0,17.78; GPIO1 -22.86,27.94; GPIO2 -22.86,30.48; GPIO3 -22.86,33.02; GPIO4 -22.86,35.56; GPIO5 -22.86,38.1; GPIO6 -22.86,40.64; GPIO7 -22.86,43.18; GPIO19 0,43.18; GPIO20 0,40.64; GPIO21 0,38.1; GPIO26 0,35.56; GPIO33 0,27.94; GPIO34 0,25.4; GPIO35 0,22.86; GPIO36 0,20.32; GPIO37 -22.86,7.62; GPIO38 -22.86,25.4; GPIO39 -22.86,22.86; GPIO40 -22.86,20.32; GPIO41 -22.86,17.78; GPIO42 -22.86,15.24; GPIO45 -22.86,12.7; GPIO46 -22.86,10.16; GPIO47 0,30.48; GPIO48 0,33.02; RST 0,15.24; RX 0,10.16; TX 0,12.7; VEXT@3 0,5.08; VEXT@4 0,7.62
TO-92 = drill 0.55 pad 1.016: 1 -1.27,0; 2 0,1.27; 3 1.27,0
SOT-23-6@1 = smd 1.1 x 0.6: 1 -1.35,0.95; 2 -1.35,0; 3 -1.35,-0.95; 4 1.35,-0.95; 5 1.35,0; 6 1.35,0.95
SOP-8 = smd 0.635 x 1.27: P$1 -1.905,-2.794; P$2 -0.635,-2.794; P$3 0.635,-2.794; P$4 1.905,-2.794; P$5 1.905,2.794; P$6 0.635,2.794; P$7 -0.635,2.794; P$8 -1.905,2.794
SOT-23-6 = smd 1.1 x 0.6: 1 -1.35,0.95; 2 -1.35,0; 3 -1.35,-0.95; 4 1.35,-0.95; 5 1.35,0; 6 1.35,0.95

### Placement (x,y rotation side)
B1  44.5,47.55 0 top
B2  44.5,39.93 0 top
C1  29.26,55.42 0 bottom
C2  29.26,47.3 0 bottom
C3  19.73,36.12 180 bottom
C4  61.64,10.08 270 bottom
C5  43.23,22.78 90 bottom
D1  47.67,48.82 0 bottom
D2  74.98,45.01 0 bottom
F1  74.98,39.93 180 bottom
J1  10.21,14.53 90 top
J2  17.67,27.23 0 top
J3  29.07,27.23 0 top
J4  18.67,20.88 0 bottom
J5  30.07,20.88 0 bottom
J6  14.02,15.8 0 top
J7  41.32,17.07 90 top
J8  85.14,12.62 270 bottom
J9  81.96,42.47 90 top
J10  85.52,42.47 90 top
J11  85.14,20.88 270 bottom
J12  80.69,33.58 90 bottom
J13  67.36,36.12 0 bottom
J14  44.5,38.66 180 bottom
J15  27.35,9.45 0 bottom
L1  38.15,51.36 90 bottom
Q1  57.83,14.53 90 bottom
Q2  52.75,14.53 90 bottom
R1  48.31,51.99 0 bottom
R1/2  57.2,51.49 90 bottom
R2  48.31,54.53 180 bottom
R3  62.28,43.1 90 bottom
R4  59.74,43.1 90 bottom
R5  19.73,33.58 180 bottom
R6  36.88,17.07 180 bottom
R7  55.29,17.7 180 bottom
R8  59.1,10.08 90 bottom
R9  56.56,10.08 90 bottom
R10  54.02,10.08 270 bottom
R10A  40.69,22.78 90 bottom
R10B  37.51,22.78 0 bottom
R11  51.48,10.08 270 bottom
R12  47.04,20.24 0 bottom
S1  1.7,40.56 270 top
S2  8.3,23.42 180 top
S3  70.92,1.83 0 top
S4  86.41,34.21 90 top
S5  48.94,43.1 90 bottom
SJ1  5.13,42.47 270 top
SJ2  5.13,38.66 90 top
SJ3  8.3,23.42 90 top
SJ4  51.48,36.12 270 bottom
SJ6  69.65,3.1 0 top
U1  78.15,28.5 90 top
U2  14.65,34.85 270 top
U3  14.65,53.26 270 top
U4  29.26,51.36 90 bottom
U5  71.8,12.62 0 bottom
U6  47.04,24.05 180 bottom

### Tracks (layer width: path | path; a pad name or v marks a point on that pad's centre or on a via)
$X
  cutout Bottom: 10.97,56.95 arc180 10.97,52.88 arc180
$X1
  cutout Bottom: 78.03,56.95 arc180 78.03,52.88 arc180
$X2
  cutout Top: 78.03,4.12 arc180 78.03,0.05 arc180
$X3
  cutout Top: 10.97,4.12 arc180 10.97,0.05 arc180
$X4
  cutout Top: 10.97,56.95 arc180 10.97,52.88 arc180
$X5
  cutout Top: 78.03,56.95 arc180 78.03,52.88 arc180
$X6
  cutout Bottom: 78.03,4.12 arc180 78.03,0.05 arc180
$X7
  cutout Bottom: 10.97,4.12 arc180 10.97,0.05 arc180
GND  (via drill 0.35)
  Bottom 0.406: U5.P$7 U5.P$2 | U5.P$2 U5.P$1 73.96,9.83 U1.GND@36 | U5.P$2 U5.P$3 U5.P$4 v65.45,9.83 62.34,9.83 C4.2 60.37,7.86 57.83,7.86 R9.1 56.21,9.13 54.31,11.03 R10.1 52.76,12.3 52.76,14.81 52.09,15.48 Q2.2 | C3.2 21.45,36.12 29.07,28.5 J3.-
  Bottom 0.61: J12.2 81.93,34.08 81,35.38 J12.A@2 J12.A@1 79.36,29.7 U1.GND@1 | J4.GND 14.67,17.69 J6.GND | J13.VIN- 55.93,37.39 52.04,37.39 SJ4.1
  other vias: 26.72,53.26 54.02,54.53 55.93,52.63 47.55,50.09 47.55,47.55 53.39,47.55 57.2,47.55 57.2,50.09 61.01,47.55 61.01,50.09 61.01,55.17 26.72,51.36 58.47,55.17 61.01,52.63 43.86,55.8 32.43,53.26 33.07,47.55 26.72,49.45 17.83,51.36 42.59,46.91
  pour Top (isolate 0.305, rank 2): -1.65,58.87 -1.65,-1.92 90.59,-1.92 90.59,58.87
  pour Bottom: 26.08,57.07 26.08,45.64 43.23,45.64 43.86,46.28 62.91,46.28 62.91,57.07
  pour Bottom: 50.21,26.59 50.21,18.34 43.23,18.34 41.96,17.07 40.69,17.07 39.42,18.34 35.61,18.34 35.61,26.59
N$1
  Bottom 0.61: J10.+ 81.98,45.01 D2.A
N$2
  Top 0.406: U2.2 19.73,31.04 27.26,31.04 J3.SIG 31.8,27.23 34.34,29.77 48.94,29.77 U1.GPIO33
  Bottom 0.406: J3.SIG 31.07,29.77 39.96,38.66 J14.SIG | U3.2 15.92,50.72 18.08,48.57 18.08,46.53 15.92,44.37 U2.2 17.19,33.58 R5.1
N$3  (via drill 0.35)
  Top 0.406: J6.CSB/SDO/WAK 27.99,11.99 29.89,11.99 31.37,10.52 31.37,7.34 34.97,3.73 45.77,3.73 U1.GPIO2 49.58,7.54 59.74,7.54 v63.55,11.35
  Bottom 0.406: R9.2 56.87,11.03 58.77,9.13 R8.1 59.38,9.13 61.29,11.03 C4.1 61.96,11.35 v63.55,11.35
N$4
  Top 0.406: J13.SCL 63.55,34.85 75.61,34.85 80.06,30.4 80.06,24.69 84.87,19.88 J11.SCL | J2.SCL 18.57,25.32 34.34,25.32 U1.GPIO20
  Bottom 0.406: J2.SCL 19.66,24.41 19.66,16.36 J6.SCL | U5.P$6 71.17,16.05 71.8,16.69 85.76,16.69 86.41,17.34 86.41,18.61 J11.SCL | R3.1 J13.SCL 57.83,31.67 40.69,31.67 U1.GPIO20
N$5
  Bottom 0.61: D2.C 73.33,40.63 F1.1 74.03,30.08 U1.5V
N$6
  Bottom 0.152: U4.1 30.4,50.01
  Bottom 0.813: 40.68,48.82 38.96,47.11 L1.1 36.84,48.27 35.79,48.27 34.05,50.01 30.4,50.01
  Bottom 1.27: D1.A 40.68,48.82
N$7
  Bottom 0.406: Q1.3 59.1,14.36 R8.2
N$8
  pour Top: 11.48,17.7 12.75,17.7 11.48,16.43
N$9
  Bottom 0.406: J6.RST 30.53,17.07 R6.1
N$10
  Top 0.61: J1.2 11.23,14.55 11.23,17.67 11.19,17.7 | J7.+ 37.51,16.44 36.25,17.7 11.19,17.7 | SJ3.1 S2.2 9.93,18.97 11.19,17.7
  Bottom 0.406: R12.2 44.82,20.24 C5.1 | U6.1 44.82,23.1 43.55,21.83 C5.1 | C5.1 40.46,19.07 40.46,17.34 41.32,16.47 J7.+
N$11
  Top 0.406: J13.SDA 61.64,34.21 75.36,34.21 79.42,30.15 79.42,22.78 84.33,17.88 J11.SDA | J2.SDA 14.67,27.86 15.94,29.13 21,29.13 24.18,25.96 32.43,25.96 U1.GPIO19
  Bottom 0.406: J6.SDA 21.66,15.82 21.66,24.56 19.68,26.54 19.68,27.73 18.92,28.5 15.94,28.5 J2.SDA | J11.SDA 85.06,17.96 71.8,17.96 69.9,16.05 U5.P$5 | R4.1 J13.SDA 56.56,32.94 39.42,32.94 U1.GPIO19
N$12  (via drill 0.35)
  Top 0.406: v48.31,16.43 43.86,11.99 43.86,5 43.23,4.37 36.24,4.37 U1.GPIO7 | v50.85,24.05 v50.85,22.15
  Bottom 0.406: v50.85,24.05 U6.5 | v50.85,22.15 50.85,18.97 v48.31,16.43
N$13
  Top 0.61: S1.3 3.82,43.18 SJ1.1 17.83,43.18 20.41,40.6 37.55,40.6 46.48,31.67 69.9,31.67 U1.VEXT@3
N$14
  Bottom 0.61: J12.1 84.02,33.08 84.5,33.56 84.5,34.85 81.96,37.39 78.47,37.39 F1.2
N$15
  Bottom 0.61: J5.- 33.7,23.51 33.7,29.77 39.34,35.41 SJ4.2 53.95,35.41 J13.VIN+
N$16  (via drill 0.35)
  Top 0.406: S4.P$1 87.04,32.45 v87.04,32.94
  Bottom 0.406: U1.GPIO42 64.18,4.37 79.42,4.37 84.5,9.45 85.77,9.45 88.31,11.99 88.31,31.67 v87.04,32.94
N$17
  Bottom 0.61: R1.1 51.48,51.99 53.39,50.09 55.38,50.09 56.78,51.49 R1/2.3
N$18
  Bottom 0.406: U6.3 41.96,25 R10A.2 38.21,23.73 R10B.2
N$19
  Top 0.61: S1.1 3.82,37.95 SJ2.1 10.81,32.27 10.81,21.82 13.24,19.61 59.1,19.61 U1.3V3@34
N$20
  Bottom 0.61: S5.P$2 48.94,39.29 47.04,37.39 40.05,37.39 32.43,29.77 32.43,24.24 J5.+
N$21
  Top 0.61: S2.1 SJ3.2 7.67,24.13 7.03,23.5 7.03,18.07 9.57,15.53 J1.1 9.55,15.53 8.94,14.92 8.94,12.62 20.37,1.19 67.74,1.19 S3.1 68.93,2.39 SJ6.1 68.93,3.48 69.57,4.12 73.46,4.12 74.34,5 74.34,8.81 79.15,13.62 J8.-
  pour Top (no thermals): 9.55,15.55 8.94,16.16 8.94,14.94
N$22
  Bottom 0.61: U4.3 28.31,50.51 29.16,51.36 44.3,51.36 45.35,52.41 45.35,54.95 46.33,55.93 55.29,55.93 R1/2.2
N$23
  Bottom 0.61: R2.2 51.61,54.53 R1/2.1
N$24  (via drill 0.35)
  Top 0.406: U1.GPIO3 45.13,11.99 v50.21,17.07 | v51.61,25 v51.61,21.51
  Bottom 0.406: v51.61,25 U6.4 | v51.61,21.51 51.61,18.47 v50.21,17.07
N$25  (via drill 0.35)
  Top 0.813: v43.9,52.63 46.44,50.09 S5.P$6
  Bottom 0.61: C1.1 30.66,54.61 29.26,53.21 U4.5 U4.4
  Bottom 0.813: C1.1 38.04,55.42 L1.2 38.99,55.36 39.98,54.12 42.41,54.12 v43.9,52.63
N$26
  Bottom 0.61: S5.P$4 S5.P$1
N$27
  Bottom 0.406: J15.SCLK 34.07,3.73 50.85,3.73 U1.GPIO38
N$28  (via drill 0.35)
  Bottom 0.61: v19.1,48.82 22.91,45.01 28.37,45.01 C2.1 36.55,41.4 S5.P$3 47.71,42.67 47.71,46.28 49.87,48.44 D1.C 49.87,49.23 47.36,51.74 R1.2
N$29
  Bottom 0.406: J15.MOSI 25.62,10.72 34.97,10.72 U1.GPIO5
N$30
  Top 0.61: SJ6.2 70.36,2.39 S3.2 72.19,3.1 74.98,3.1 76.88,5 76.88,10.08 78.42,11.62 J8.+ 88.31,15.43 88.31,37.12 J9.+
  Top 0.813: J9.+ 81.6,43.1 21,43.1 B1.+
  Bottom 0.406: Q1.2 56.44,15.78 56.44,17.51 R7.2 59.42,20.88 85.77,20.88 87.04,19.61 87.04,13.53 J8.+
  Bottom 0.813: B1.+ 16.12,47.55 B2.+
N$31
  Bottom 0.406: J15.MISO 32.7,3.1 52.75,3.1 U1.GPIO39
N$32
  Top 0.406: U1.GPIO6 37.51,6.91 31.16,13.26 29.26,13.26 J6.SDO/CS/INT
  Bottom 0.406: R11.2 51.16,8.81 41.96,8.81 38.78,11.99 30.53,11.99 J6.SDO/CS/INT
N$33
  Bottom 0.406: J15.CS 24.26,11.35 36.88,11.35 U1.GPIO4
N$34
  Bottom 0.406: R12.1 48.39,20.64 U6.6 57.52,23.1 U1.RST
N$35
  Bottom 0.406: Q1.1 55.78,14.53 Q2.3 54.15,14.83 54.15,17.51 R7.1
N$37
  Bottom 0.406: R10.2 53.69,9.13 51.79,11.03 R11.1 51.48,13.41 Q2.1
N$38
  Top 0.406: J4.SPD 20.48,24.69 41.32,24.69 U1.GPIO48
N$39
  Top 0.406: J4.DIR 21.84,24.05 43.23,24.05 U1.GPIO47
N$40
  Top 0.406: J4.RAIN 23.21,23.42 47.67,23.42 U1.GPIO34
VEXT  (via drill 0.35)
  Top 0.61: S1.2 3.89,39.37 SJ2.2@V SJ1.2
  other vias: 19.1,53.9
  pour Bottom (isolate 0.305, rank 2): -0.65,57.87 -0.65,-0.92 89.59,-0.92 89.59,57.87

### Text on the board
Bottom: v1.0
tPlace: 10068-BHWL3 v1.0 | digitalconcepts.net.au | Vcc | GND | SCL | SDA | RST | ADD | CSB / SDO / WAK | SDO / CS / INT
bPlace: Vin+ | Vin- | SDA | SCL | GND | Vcc | S/N | 1 | 2 | 3 | 4
tNames: Vext | Vint | A4a Sensor Interface | ON
bNames: Vcc | GND | Boost | Boost | Bypass | Vcc | GND | J4A | J5A | SCL | SDA | J8A
bValues: Wind/Rain